# EAGLE design fonte_simétrica (EAGLE 9.5.1)
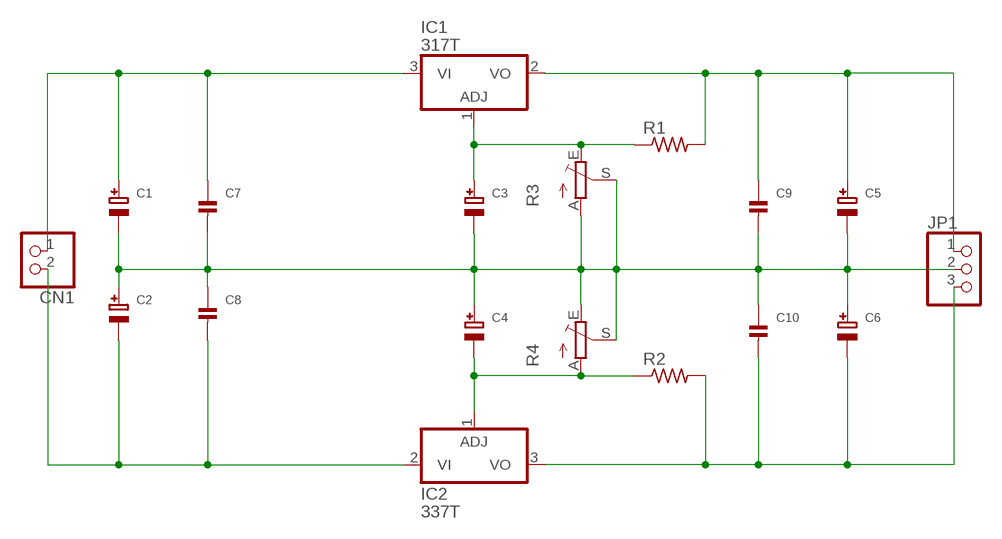
[diagram p0: schematic, sheet 1]

## Parts
C1  CAP_ELECTROLYTICPTH_3.5MMGRID_10MMDIA  [CELEC_3.5MM_10MM]
C2  CAP_ELECTROLYTICPTH_3.5MMGRID_10MMDIA  [CELEC_3.5MM_10MM]
C3  CAP_ELECTROLYTICPTH_3.5MMGRID_8MMDIA  [CELEC_3.5MM_8MM]
C4  CAP_ELECTROLYTICPTH_3.5MMGRID_8MMDIA  [CELEC_3.5MM_8MM]
C5  CAP_ELECTROLYTICPTH_3.5MMGRID_8MMDIA  [CELEC_3.5MM_8MM]
C6  CAP_ELECTROLYTICPTH_3.5MMGRID_8MMDIA  [CELEC_3.5MM_8MM]
C7  CAP_CERAMIC0402  [0402]
C8  CAP_CERAMIC0402  [0402]
C9  CAP_CERAMIC0402  [0402]
C10  CAP_CERAMIC0402  [0402]
CN1  JST_2PIN-SMT  [JST-PH-2-SMT]
IC1  317T  [TO220H]
IC2  337T  [TO220H]
JP1  PINHD-1X3  [1X03]
R1  R-US_0204/7  [0204/7]
R2  R-US_0204/7  [0204/7]
R3  TRIM_1234-S64YW  [S64YW]
R4  TRIM_1234-S64YW  [S64YW]

## Nets
N$1: C1.+ C7.1 CN1.1 IC1.3(VI)
N$2: C1.- C2.+ C3.- C4.+ C5.- C6.+ C7.2 C8.1 C9.2 C10.1 JP1.2 R3.A R3.S R4.E R4.S
N$3: C6.- C10.2 IC2.3(VO) JP1.3 R2.2
N$4: C2.- C8.2 CN1.2 IC2.2(VI)
N$5: C3.+ IC1.1(ADJ) R1.1 R3.E
N$7: C5.+ C9.1 IC1.2(VO) JP1.1 R1.2
N$8: C4.- IC2.1(ADJ) R2.1 R4.A
Unconnected: R3.S@1(S) R4.S@1(S)

## Library data of the parts
C1-C6 = microbuilder:CAP_ELECTROLYTIC: Electrolytic Capacitors SMT PANASONIC_C - Size C Panasonic Electrolytic Aluminum Capacitor 47µF 16V 20% Electrolytic Capacitor [Digikey: PCE3890TR-ND] PANASONIC_D - Size D Panasonic Electrolytic Aluminum Capacitor 100µF 25V 20% Electrolytic Capacitor [Digikey: PCE3898TR-ND] PTH 3.5 mm grid, 8 mm diameter ... 3.5 mm grid, 10 mm diameter ...
C7-C10 = microbuilder:CAP_CERAMIC: Ceramic Capacitors 0402 - 0402 Surface Mount Capacitors 16pF 50V 5% [Digikey: 445-4899-2-ND] 18pF 50V 5% [Digikey: 490-1281-2-ND] 22pF 50V 5% [Digikey: 490-1283-2-ND] 68pF 50V 5% [Digikey: 490-1289-2-ND] 0.1uF 10V 10% [Digikey: 490-1318-2-ND] 1.0uF 6.3V 10% [Digikey: 490-1320-2-ND] 0603 - 0603 Surface Mount Capacitors 16 pF 50V 5% [Digikey: 445-5051-2-ND] 22 pF 50V [Digikey: PCC220ACVTR-ND] 33 pF 50V 5% [Digikey: 490-1415-1-ND] 56pF 50V 5% [Digikey: 490-1421-1-ND] 220pF 50V 5% [Digikey: 445-1285-1-ND] 680 pF 50V 2200 pF 50V 5% C0G [Digikey: 445-1297-1-ND] 5600 pF 100V 5% X7R [Digikey: 478-3711-1-ND] 0.1 µF 25V 10% [Digikey: PCC2277TR-ND] 0.22 µF 16V 10% X7R [Digikey: 445-1318-1-ND] 1.0 µF 25V 10% [Digikey: 445-5146-2-ND] 0603 - RF Specific 3pF 250V +/-0.1pF RF [Digikey: 712-1347-1-ND] 18 pF 250V 5% [Digikey: 478-3505-1-ND or 712-1322-1-ND] 56 pF 250V 5% C0G RF [Digikey: 490-4867-1-ND] 68 pF 250V RF [Digikey: 490-4868-1-ND] 0805 - 0805 Surface Mount Capacitors 220 pF 250V 2% RF Ceramic Capacitor [Digikey: 712-1398-1-ND] 1000 pF 50V 2% NP0 Ceramic Capacitor [Digikey: 478-3760-1-ND] 0.1 µF 25V 10% Ceramic Capacitor [Digikey: PCC1828TR-ND] 1.0 µF 16V 10% Ceramic Capacitor[Digikey: 490-1691-2-ND] 10.0 µF 10V 10% Ceramic Capacitor[Digikey: 709-1228-1-ND] 10.0 uF 16V 10% Ceramic Capacitor [Digikey: 478-5165-2-ND] 47 uF 6.3V 20% Ceramic Capacitor [Digikey: 587-1779-1-ND or 399-5506-1-ND] 1206 - 1206 Surface Mount Capacitors 47uF 10V 20% Ceramic Capacitor [Digikey: 490-5528-1-ND or 399-5508-1-ND or 445-6010-1-ND] 100uF 6.3V -20%, +80% Y5V Ceramic Capacitor (Digikey: 490-4512-1-ND, Mouser: 81-GRM31CF50J107ZE1L)
CN1 = adafruit:JST_2PIN: JST 2-Pin Connectors of various flavors SMT-RA (S2B-PH-SM4) 4UConnector #17311 SMT (B2B-PH-SM4) THM-RA (S2B-PH) THM (B2B-PH)
IC1 = linear:*317: Positive VOLTAGE REGULATOR
IC2 = linear:*337: Negative VOLTAGE REGULATOR
JP1 = adafruit:PINHD-1X3: PIN HEADER
R1 R2 = adafruit:R-US_: RESISTOR, American symbol
R3 R4 = pot:TRIM_1234-: POTENTIOMETER

## Board
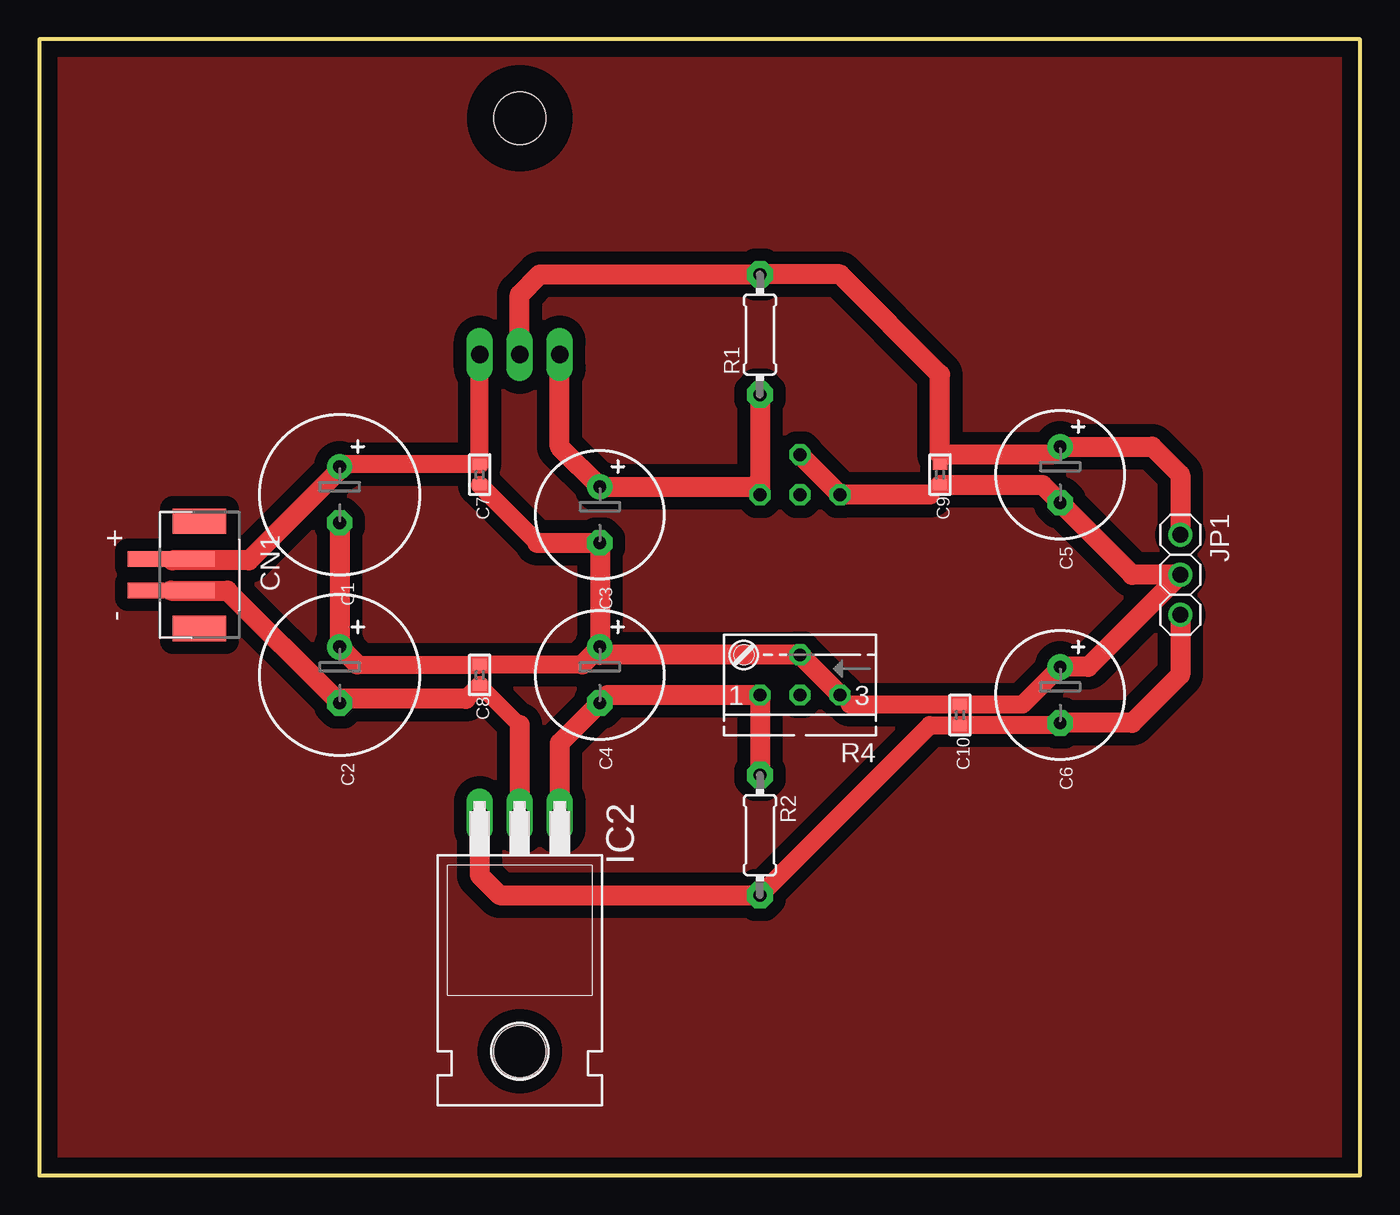
[diagram p1: board, top side]
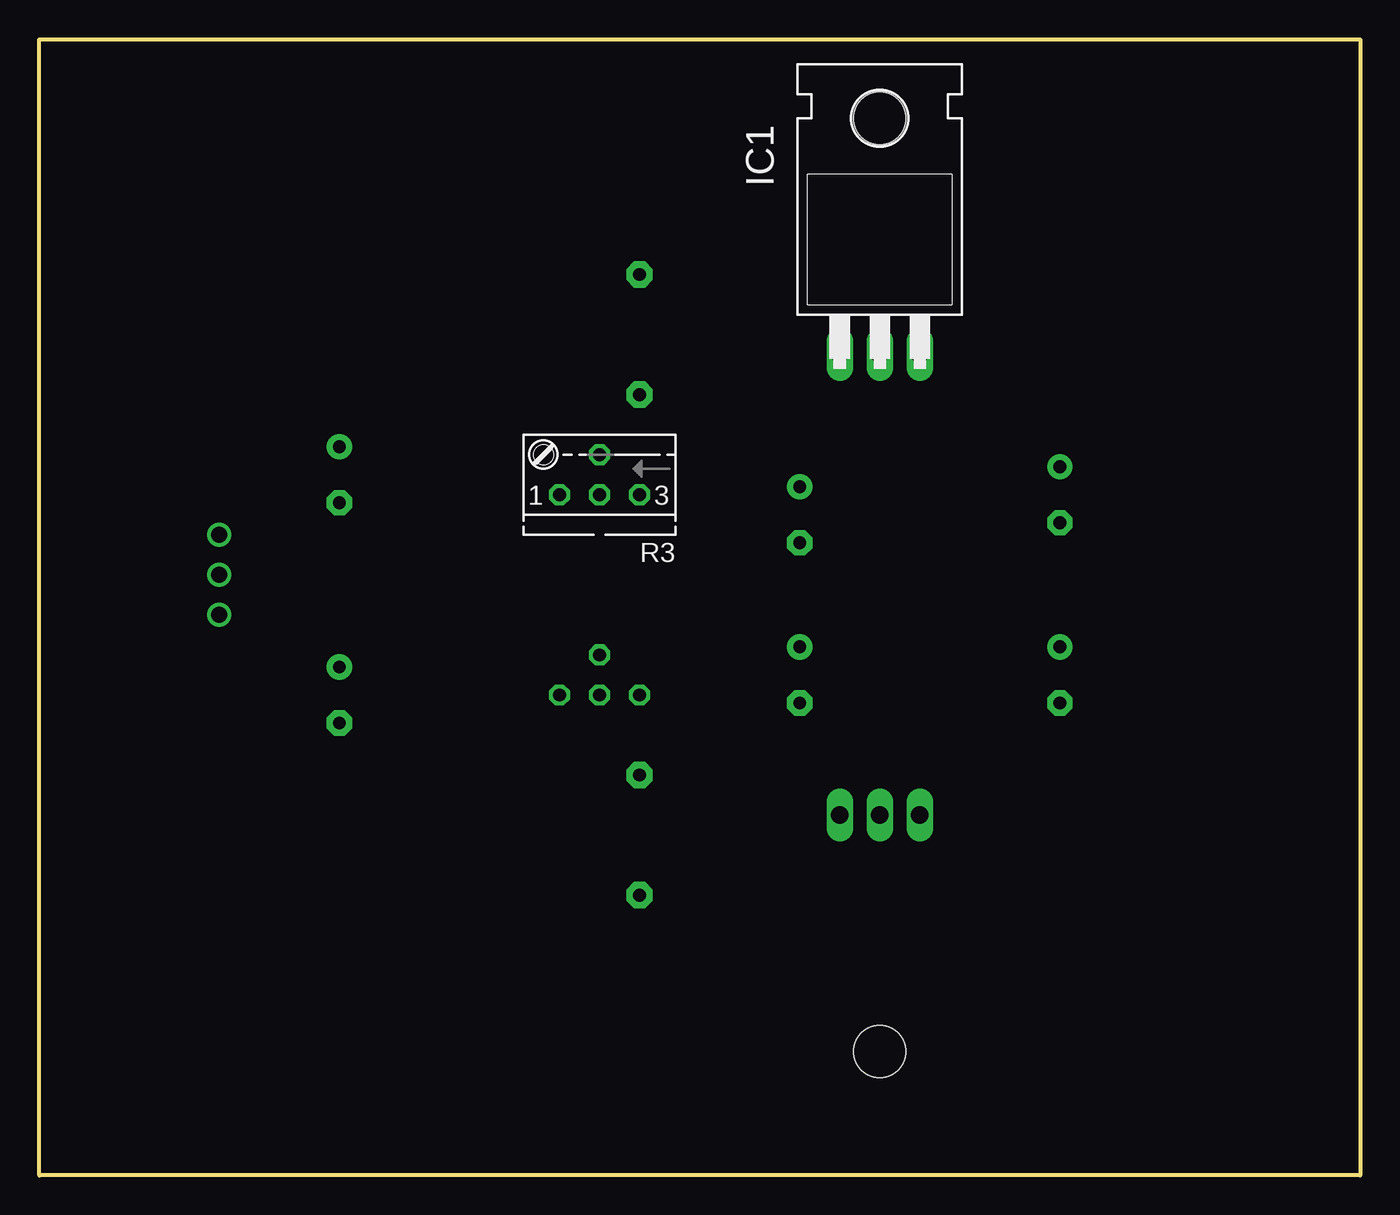
[diagram p2: board, bottom side, seen from below]

Size 83.8 x 72.06 mm. Coordinates in mm from the lower left corner, seen from the top.
Outline: 0,0 83.8,0 83.8,72.06 0,72.06 0,0
Copper layers (1*16): Top 0.035mm / dielectric 1.5mm / Bottom 0.035mm
Design rules "default": minimum track width 6mil, minimum drill 0.35mm, track to track 6mil, track to pad 6mil, pad to pad 6mil, via to via 6mil, smd to smd 6mil, copper to edge 40mil, drill to drill 6mil, minimum pad ring 10mil, minimum via ring 8mil, stop-mask expansion 4mil, vias tented up to drill 0mil, thermal gap 10mil

### Footprints (pad centres in the part's own frame; a part is rotated, then mirrored left to right if it is on the bottom)
CELEC_3.5MM_10MM = drill 0.813 pad 1.6: + -1.778,0 | drill 0.813 pad 1.6 octagon: - 1.778,0
CELEC_3.5MM_8MM = drill 0.813 pad 1.6: + -1.778,0 | drill 0.813 pad 1.6 octagon: - 1.778,0
0402 = smd 0.7 x 0.9: 1 -0.65,0; 2 0.65,0
JST-PH-2-SMT = smd 1 x 5.5: 1 -1,-1.8; 2 1,-1.8 | smd 1.6 x 3.4: NC1 -3.4,0; NC2 3.4,0
TO220H = drill 1.118 long: 1 -2.54,-10.16; 2 0,-10.16; 3 2.54,-10.16 | hole 3.302: 0,4.826
1X03 = drill 1.016: 1 -2.54,0; 2 0,0; 3 2.54,0
0204/7 = drill 0.813 pad 1.676 octagon: 1 -3.81,0; 2 3.81,0
S64YW = drill 0.813 octagon: A 2.54,1.27; E -2.54,1.27; S 0,-1.27; S@1 0,1.27

### Placement (x,y rotation side)
C1  19.05,43.18 270 top
C2  19.05,31.75 270 top
C3  35.56,41.91 270 top
C4  35.56,31.75 270 top
C5  64.77,44.45 270 top
C6  64.77,30.48 270 top
C7  27.94,44.45 270 top
C8  27.94,31.75 270 top
C9  57.15,44.45 270 top
C10  58.42,29.21 270 top
CN1  10.16,38.1 270 top
IC1  30.48,62.23 0 bottom
IC2  30.48,12.7 180 top
JP1  72.39,38.1 270 top
R1  45.72,53.34 90 top
R2  45.72,21.59 270 top
R3  48.26,44.45 180 bottom
R4  48.26,31.75 180 top

### Tracks (layer width: path | path; a pad name or v marks a point on that pad's centre or on a via)
GND
  pour Top (isolate 0.813): 0,72.39 83.82,72.39 83.82,0 0,0
N$1
  Top 0.508: CN1.1 8.44,39.02 | 19.19,45.1 C1.+
  Top 1.143: IC1.3 C7.1 19.19,45.1
  Top 1.27: 8.44,39.02 13.3,39.02 19.05,44.77 C1.+
N$2
  Top 0.508: C4.+ 35.31,33.27 35.56,33.02 | 51.42,29.86 R4.E | C9.2 56.53,43.18
  Top 1.143: 20.18,32.4 C8.1 34.43,32.4 | C7.2 31.61,40.13 | 51.42,29.86 C10.1 62.37,29.86 C6.+
  Top 1.27: C1.- C2.+ 20.18,32.4 | 31.61,40.13 C3.- C4.+ | 35.31,33.27 34.43,32.4 | R4.E R4.S 35.56,33.02 | R3.S R3.A 56.53,43.18 | C9.2 63.64,43.8 C5.- 69.34,38.1 JP1.2 66.55,32.26 C6.+
N$3
  Top 0.508: C6.- 64.63,28.56
  Top 1.143: R2.2 56.5,28.56 C10.2 64.63,28.56
  Top 1.27: JP1.3 72.39,31.75 69.34,28.7 C6.- | IC2.3 27.94,19.05 29.21,17.78 R2.2
N$4
  Top 0.508: 18.8,30.23 C2.-
  Top 1.016: C8.2 30.48,28.56
  Top 1.143: C8.2 27.07,30.23
  Top 1.27: CN1.2 11.92,37.1 18.8,30.23 27.07,30.23 | 30.48,28.56 IC2.2
N$5
  Top 0.508: 45.21,43.69 R3.E
  Top 1.27: 45.21,43.69 C3.+ 33.02,46.23 IC1.1 | R1.1 R3.E
N$7
  Top 0.508: C9.1 57.15,45.72 | C5.+ 64.26,45.72
  Top 1.27: 64.26,45.72 57.15,45.72 57.15,50.8 50.8,57.15 R1.2 31.75,57.15 30.48,55.88 IC1.2 | C5.+ 70.61,46.23 72.39,44.45 JP1.1
N$8
  Top 0.508: C4.- 36.07,30.48
  Top 1.27: C4.- 33.02,27.43 IC2.1 | R2.1 R4.A 36.07,30.48